# EAGLE design wheelBoardStock (EAGLE 6.3)
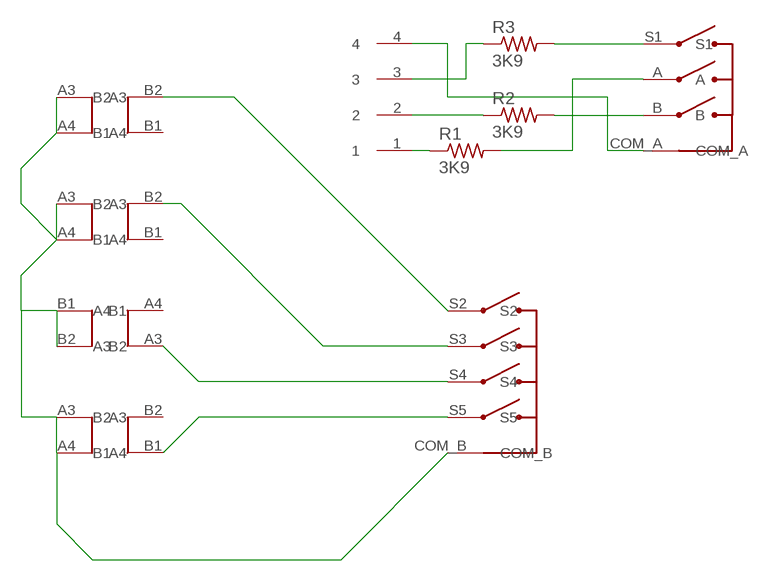
[diagram p0: schematic, sheet 1]

## Parts
R1  3K9  R-US_R1206  [R1206]
R2  3K9  R-US_R1206  [R1206]
R3  3K9  R-US_R1206  [R1206]
U$1  TSWB-3N-CB222  [W/DIREC]
U$2  9X_TACT_PATCH  [9XTACTPADS]
U$3  9X_TACT_PATCH  [9XTACTPADS]
U$4  9X_TACT_PATCH  [9XTACTPADS]
U$5  9X_TACT_PATCH  [9XTACTPADS]
U$6  2MM_4P_HEADER  [JST2MM_4P]

## Nets
COM_A: U$1.COM_A U$6.4
COM_B: U$1.COM_B U$2.A3 U$2.A4 U$3.A3 U$3.A4 U$4.B1 U$4.B2 U$5.A3 U$5.A4
N$1: R1.1 U$6.1
N$2: R2.1 U$6.2
N$3: R3.1 U$6.3
PHASE_A: R1.2 U$1.A
PHASE_B: R2.2 U$1.B
S2: U$1.S2 U$2.B2
S3: U$1.S3 U$3.B2
S4: U$1.S4 U$4.A3
S5: U$1.S5 U$5.B1
SELECT: R3.2 U$1.S1
Unconnected: U$2.B1 U$3.B1 U$4.A4 U$5.B2

## Library data of the parts
R1-R3 = rcl:R-US_: RESISTOR, American symbol
U$1 = iksbob:TSWB-3N-CB222: Central select with jog and 4 directions
U$2-U$5 = iksbob:9X_TACT_PATCH
U$6 = iksbob:2MM_4P_HEADER

## Board
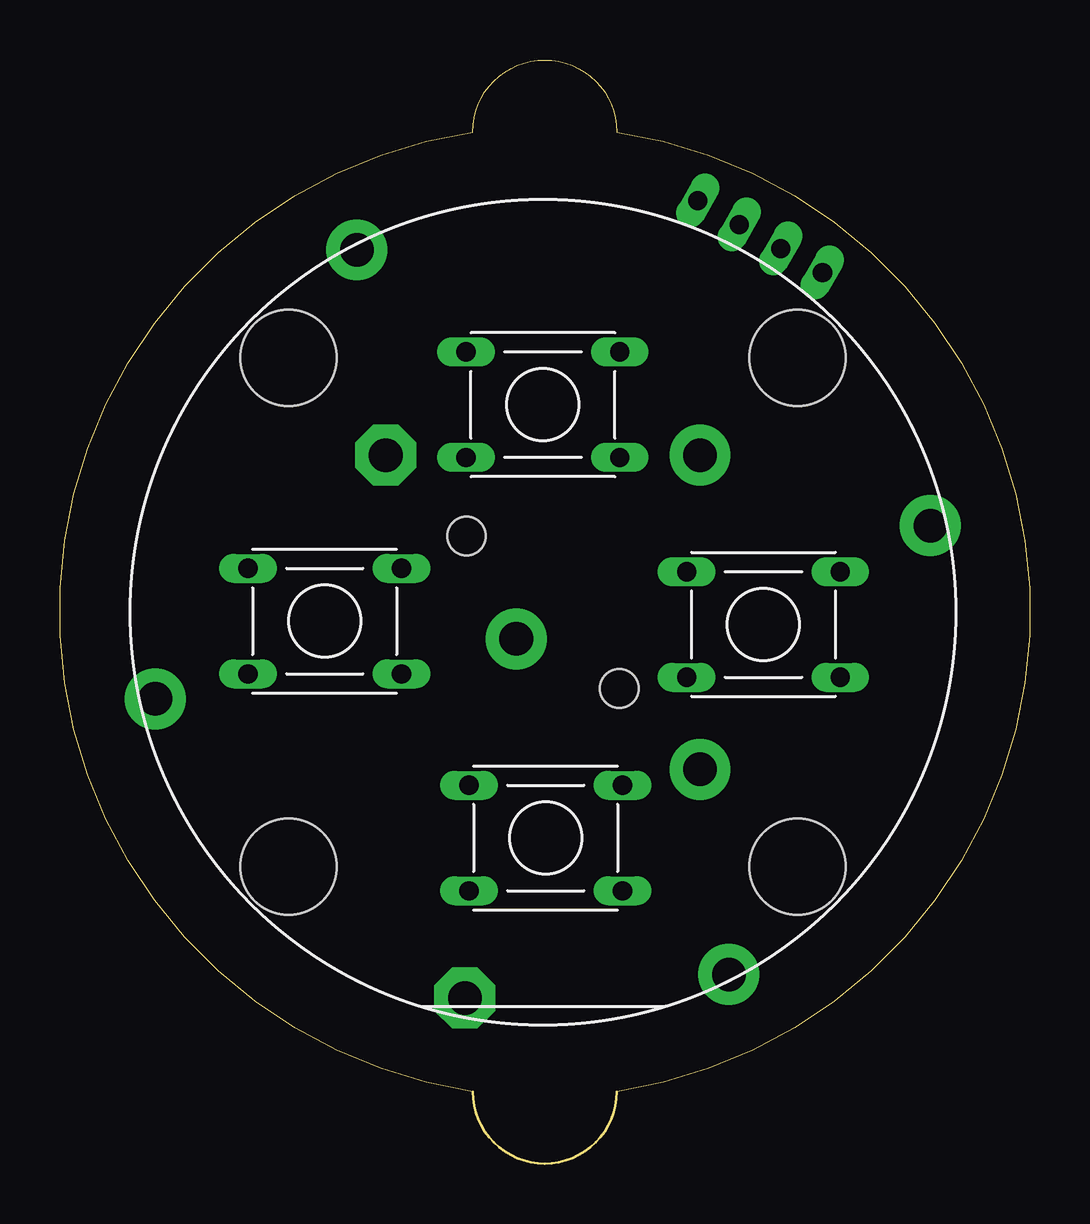
[diagram p1: board, top side]
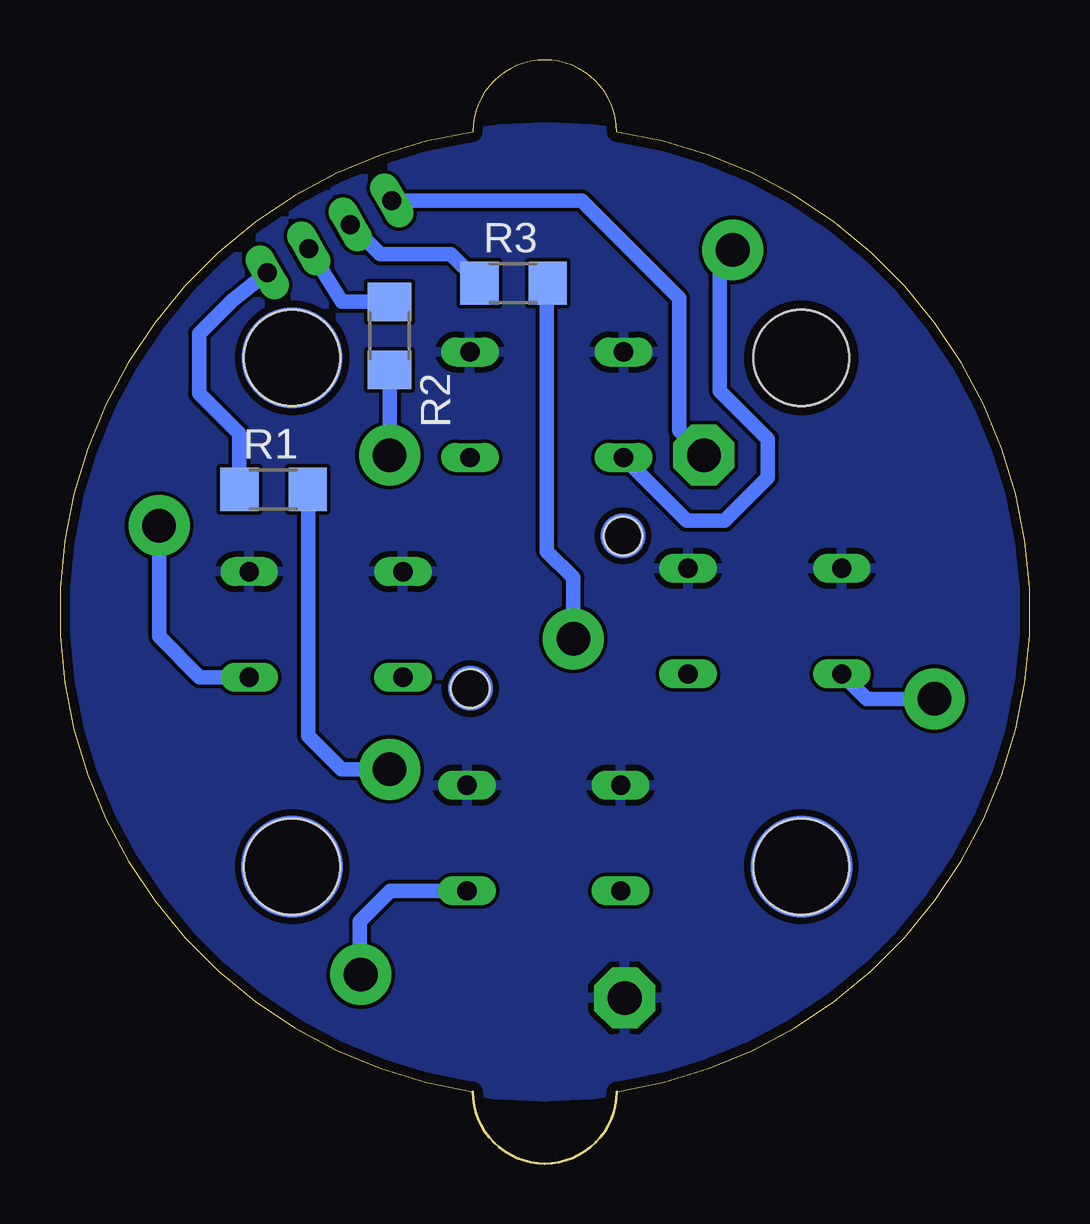
[diagram p2: board, bottom side, seen from below]

Size 40.4 x 46 mm. Coordinates in mm from the lower left corner, seen from the top.
Outline: 17.2,43 arc-180 23.2,43 arc-163 23.2,3 arc-180 17.2,3 arc-163 17.2,43
Copper layers (1*16): Top 0.0356mm / dielectric 1.5011mm / Bottom 0.0356mm
Design rules "LaenPCBOrder": minimum track width 6mil, minimum drill 13mil, track to track 6mil, track to pad 6mil, pad to pad 6mil, via to via 6mil, smd to smd 6mil, copper to edge 15mil, drill to drill 6mil, minimum pad ring 7mil, minimum via ring 7mil, stop-mask expansion 4mil, vias tented up to drill 0mil, thermal gap 10mil

### Footprints (pad centres in the part's own frame; a part is rotated, then mirrored left to right if it is on the bottom)
R1206 = smd 1.6 x 1.803: 1 -1.422,0; 2 1.422,0
W/DIREC = drill 1.4 pad 2.54: A 0,-9.26; B 9.26,0; S1 -1.57,0; S2 -5.2,-16.16; S3 13.97,-8.87; S4 5.2,16.16; S5 -13.97,8.87 | drill 1.4 pad 2.54 octagon: COM_A 0,9.26; COM_B -13.67,-9.07 | hole 4: -15,0; 0,-15; 15,0; 0,15 | hole 1.6: 0,4.5; 0,-4.5
9XTACTPADS = drill 0.8 long: A3 3.2,2.2; A4 -3.2,2.2; B1 -3.2,-2.2; B2 3.2,-2.2
JST2MM_4P = drill 0.8 long: 1 0,3; 2 0,1; 3 0,-1; 4 0,-3

### Placement (x,y rotation side)
R1  31.5,28.1 0 bottom
R2  26.67,34.5 270 bottom
R3  21.5,36.7 0 bottom
U$1  20.12,22.98 45 top
U$2  20.24,13.57 0 top
U$3  29.31,22.47 0 top
U$4  20.12,31.63 180 top
U$5  11.03,22.61 0 top
U$6  29.17,38.64 240 top

### Tracks (layer width: path | path; a pad name or v marks a point on that pad's centre or on a via)
COM_A
  Bottom 0.61: U$1.COM_A 14.6,30.56 14.6,36.07 18.67,40.14 U$6.4
COM_B
  pour Bottom: 
  pour Bottom: -0.1,23 arc-90 20.1,43.2 20.2,43.2 arc-90 40.4,23 40.4,22.8 arc-90 20.4,2.8 20.1,2.8 arc-90
N$1
  Bottom 0.61: U$6.1 33.2,36 34.6,34.6 34.6,32.1 32.92,30.42 R1.1
N$2
  Bottom 0.61: 26.85,36.1 R2.1 28.66,35.93 U$6.2
N$3
  Bottom 0.61: U$6.3 27.06,37.9 24.12,37.9 R3.1
PHASE_A
  Bottom 0.61: U$1.A 28.66,16.43 30.06,17.83 30.06,28.08 R1.2
PHASE_B
  Bottom 0.61: R2.2 U$1.B
S2
  Bottom 0.61: U$2.B2 26.63,11.37 27.9,10.1 27.9,7.91 U$1.S2
S3
  Bottom 0.61: U$3.B2 34.57,20.27 36.26,21.96 36.26,26.58 U$1.S3
S4
  Bottom 0.61: U$4.A3 14.29,26.8 12.7,26.8 10.9,28.6 10.9,30.2 12.9,32.2 12.9,37.55 U$1.S4
S5
  Bottom 0.61: U$1.S5 6.79,19.37 U$5.B1
SELECT
  Bottom 0.61: U$1.S1 19.01,24.42 20.11,25.52 20.11,36.67 R3.2
(copper drawn outside any net)
  shapes: Bottom circle x5